# Altium schematic sheet 08_MCU.SchDoc
size 420 x 297 mm; SheetNumber: 15; SheetTotal: 29
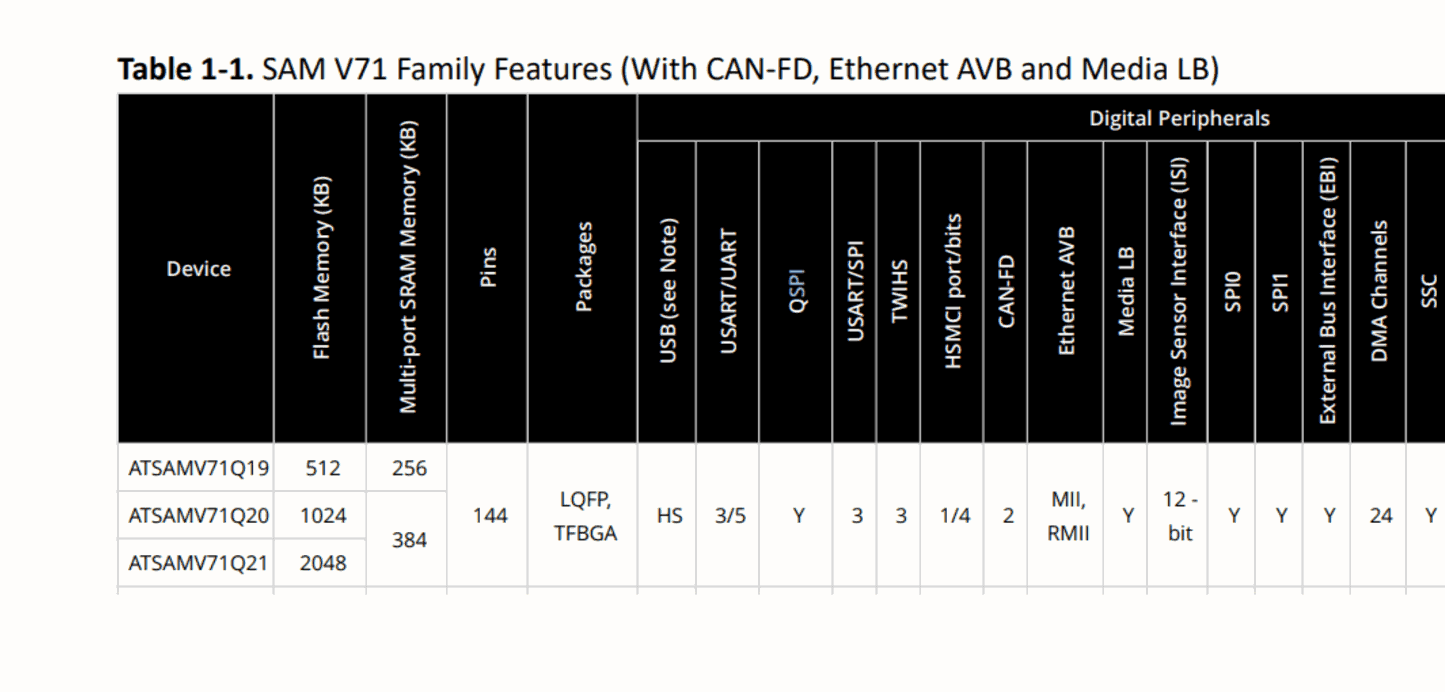
[diagram p0: 08_MCU.SchDoc, top left]
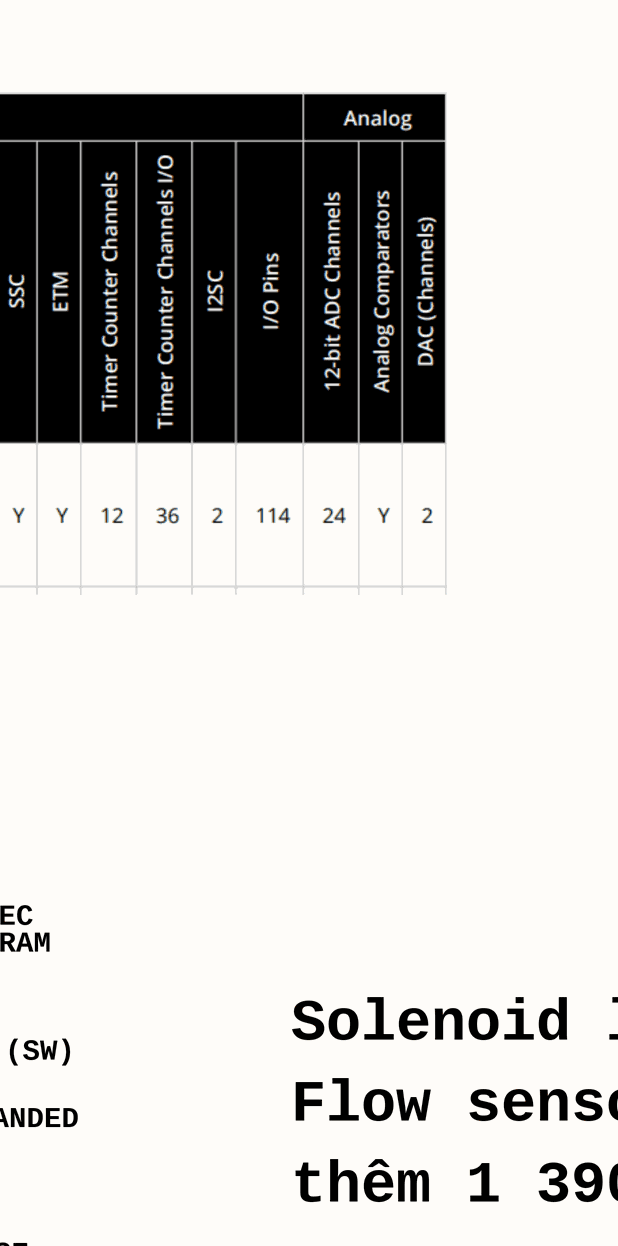
[diagram p1: 08_MCU.SchDoc, top right]
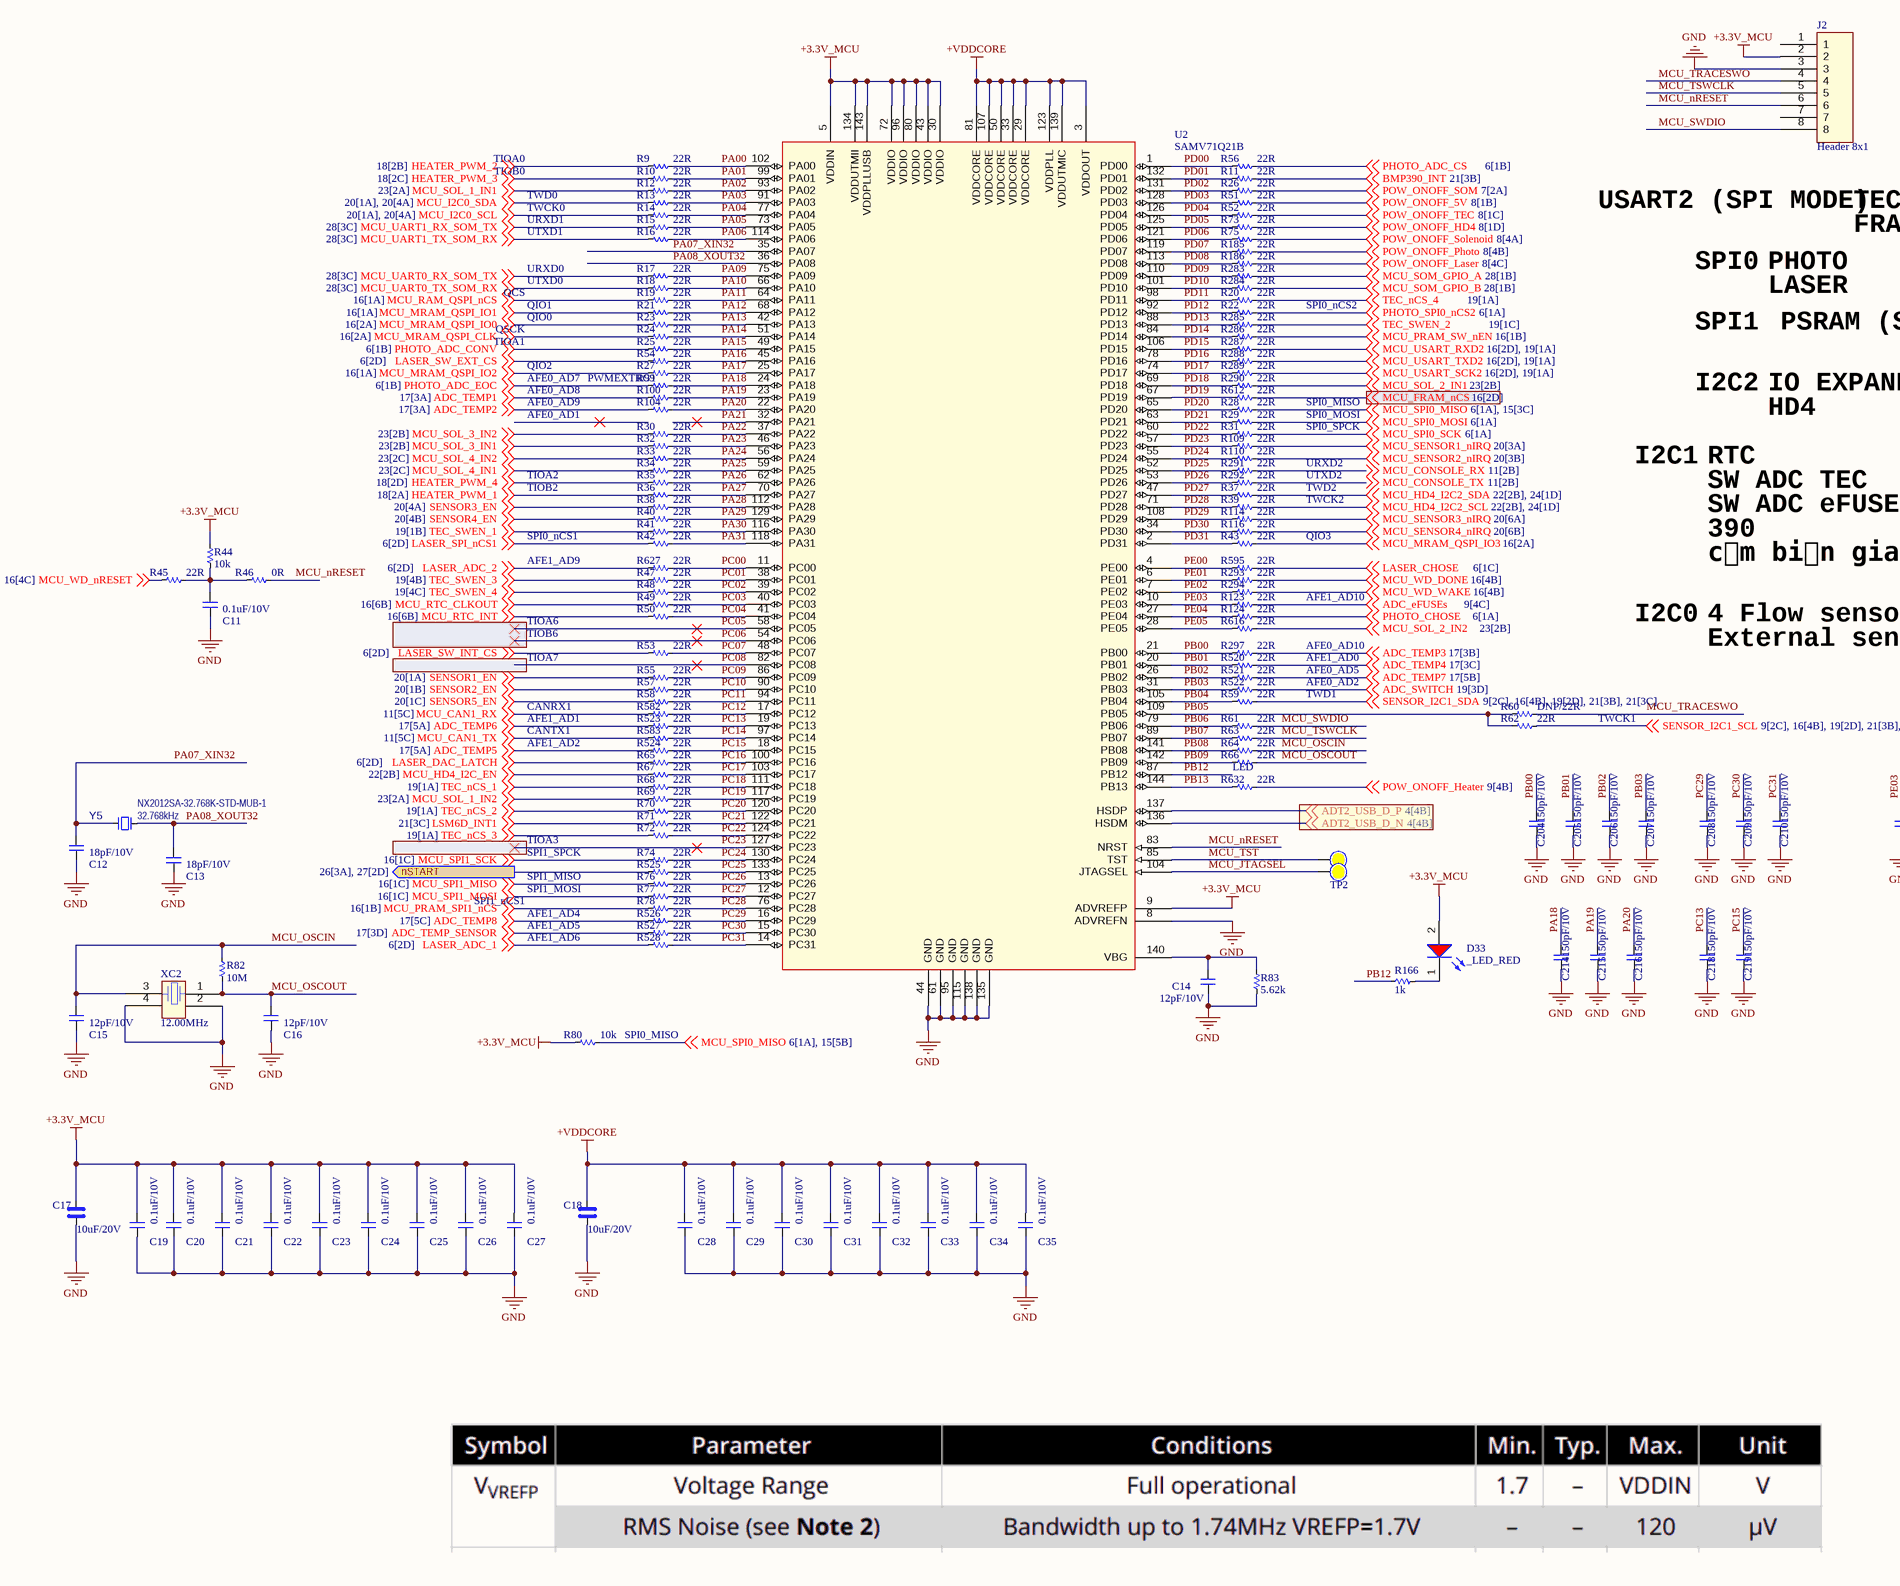
[diagram p2: 08_MCU.SchDoc, bottom left]
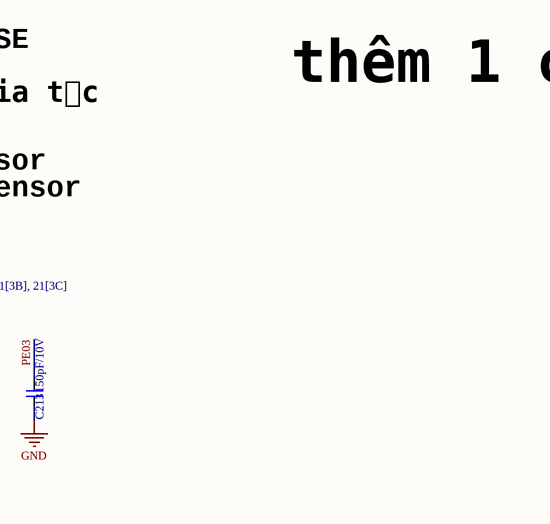
[diagram p3: 08_MCU.SchDoc, bottom right]

## Parts
C11  0.1uF/10V  [CAP_C_1005X60]
C12  18pF/10V  [CAP_C_1005X60]
C13  18pF/10V  [CAP_C_1005X60]
C14  12pF/10V  [CAP_C_1005X60]
C15  12pF/10V  [CAP_C_1005X60]
C16  12pF/10V  [CAP_C_1005X60]
C17  10uF/20V  [CAP_C_2012X110]
C18  10uF/20V  [CAP_C_2012X110]
C19  0.1uF/10V  [CAP_C_1005X60]
C20  0.1uF/10V  [CAP_C_1005X60]
C21  0.1uF/10V  [CAP_C_1005X60]
C22  0.1uF/10V  [CAP_C_1005X60]
C23  0.1uF/10V  [CAP_C_1005X60]
C24  0.1uF/10V  [CAP_C_1005X60]
C25  0.1uF/10V  [CAP_C_1005X60]
C26  0.1uF/10V  [CAP_C_1005X60]
C27  0.1uF/10V  [CAP_C_1005X60]
C28  0.1uF/10V  [CAP_C_1005X60]
C29  0.1uF/10V  [CAP_C_1005X60]
C30  0.1uF/10V  [CAP_C_1005X60]
C31  0.1uF/10V  [CAP_C_1005X60]
C32  0.1uF/10V  [CAP_C_1005X60]
C33  0.1uF/10V  [CAP_C_1005X60]
C34  0.1uF/10V  [CAP_C_1005X60]
C35  0.1uF/10V  [CAP_C_1005X60]
C204  150pF/10V  [CAP_C_1005X60]
C205  150pF/10V  [CAP_C_1005X60]
C206  150pF/10V  [CAP_C_1005X60]
C207  150pF/10V  [CAP_C_1005X60]
C208  150pF/10V  [CAP_C_1005X60]
C209  150pF/10V  [CAP_C_1005X60]
C210  150pF/10V  [CAP_C_1005X60]
C213  150pF/10V  [CAP_C_1005X60]
C214  150pF/10V  [CAP_C_1005X60]
C215  150pF/10V  [CAP_C_1005X60]
C216  150pF/10V  [CAP_C_1005X60]
C218  150pF/10V  [CAP_C_1005X60]
C219  150pF/10V  [CAP_C_1005X60]
D33  _LED_RED  [LED_0603]
J2  Header 8x1  [Header_254P_8x1]
R9  22R  [RES_C_1005X40]
R10  22R  [RES_C_1005X40]
R11  22R  [RES_C_1005X40]
R12  22R  [RES_C_1005X40]
R13  22R  [RES_C_1005X40]
R14  22R  [RES_C_1005X40]
R15  22R  [RES_C_1005X40]
R16  22R  [RES_C_1005X40]
R17  22R  [RES_C_1005X40]
R18  22R  [RES_C_1005X40]
R19  22R  [RES_C_1005X40]
R20  22R  [RES_C_1005X40]
R21  22R  [RES_C_1005X40]
R22  22R  [RES_C_1005X40]
R23  22R  [RES_C_1005X40]
R24  22R  [RES_C_1005X40]
R25  22R  [RES_C_1005X40]
R26  22R  [RES_C_1005X40]
R27  22R  [RES_C_1005X40]
R28  22R  [RES_C_1005X40]
R29  22R  [RES_C_1005X40]
R30  22R  [RES_C_1005X40]
R31  22R  [RES_C_1005X40]
R32  22R  [RES_C_1005X40]
R33  22R  [RES_C_1005X40]
R34  22R  [RES_C_1005X40]
R35  22R  [RES_C_1005X40]
R36  22R  [RES_C_1005X40]
R37  22R  [RES_C_1005X40]
R38  22R  [RES_C_1005X40]
R39  22R  [RES_C_1005X40]
R40  22R  [RES_C_1005X40]
R41  22R  [RES_C_1005X40]
R42  22R  [RES_C_1005X40]
R43  22R  [RES_C_1005X40]
R44  10k  [RES_C_1005X40]
R45  22R  [RES_C_1005X40]
R46  0R  [RES_C_1005X40]
R47  22R  [RES_C_1005X40]
R48  22R  [RES_C_1005X40]
R49  22R  [RES_C_1005X40]
R50  22R  [RES_C_1005X40]
R51  22R  [RES_C_1005X40]
R52  22R  [RES_C_1005X40]
R53  22R  [RES_C_1005X40]
R54  22R  [RES_C_1005X40]
R55  22R  [RES_C_1005X40]
R56  22R  [RES_C_1005X40]
R57  22R  [RES_C_1005X40]
R58  22R  [RES_C_1005X40]
R59  22R  [RES_C_1005X40]
R60  DNP/22R  [RES_C_1005X40]
R61  22R  [RES_C_1005X40]
R62  22R  [RES_C_1005X40]
R63  22R  [RES_C_1005X40]
R64  22R  [RES_C_1005X40]
R65  22R  [RES_C_1005X40]
R66  22R  [RES_C_1005X40]
R67  22R  [RES_C_1005X40]
R68  22R  [RES_C_1005X40]
R69  22R  [RES_C_1005X40]
R70  22R  [RES_C_1005X40]
R71  22R  [RES_C_1005X40]
R72  22R  [RES_C_1005X40]
R73  22R  [RES_C_1005X40]
R74  22R  [RES_C_1005X40]
R75  22R  [RES_C_1005X40]
R76  22R  [RES_C_1005X40]
R77  22R  [RES_C_1005X40]
R78  22R  [RES_C_1005X40]
R80  10k  [RES_C_1005X40]
R82  10M  [RES_C_1005X40]
R83  5.62k  [RES_C_1005X40]
R99  22R  [RES_C_1005X40]
R100  22R  [RES_C_1005X40]
R104  22R  [RES_C_1005X40]
R109  22R  [RES_C_1005X40]
R110  22R  [RES_C_1005X40]
R114  22R  [RES_C_1005X40]
R116  22R  [RES_C_1005X40]
R123  22R  [RES_C_1005X40]
R124  22R  [RES_C_1005X40]
R166  1k  [RES_C_1005X40]
R185  22R  [RES_C_1005X40]
R186  22R  [RES_C_1005X40]
R283  22R  [RES_C_1005X40]
R284  22R  [RES_C_1005X40]
R285  22R  [RES_C_1005X40]
R286  22R  [RES_C_1005X40]
R287  22R  [RES_C_1005X40]
R288  22R  [RES_C_1005X40]
R289  22R  [RES_C_1005X40]
R290  22R  [RES_C_1005X40]
R291  22R  [RES_C_1005X40]
R292  22R  [RES_C_1005X40]
R293  22R  [RES_C_1005X40]
R294  22R  [RES_C_1005X40]
R297  22R  [RES_C_1005X40]
R520  22R  [RES_C_1005X40]
R521  22R  [RES_C_1005X40]
R522  22R  [RES_C_1005X40]
R523  22R  [RES_C_1005X40]
R524  22R  [RES_C_1005X40]
R525  22R  [RES_C_1005X40]
R526  22R  [RES_C_1005X40]
R527  22R  [RES_C_1005X40]
R528  22R  [RES_C_1005X40]
R582  22R  [RES_C_1005X40]
R583  22R  [RES_C_1005X40]
R595  22R  [RES_C_1005X40]
R612  22R  [RES_C_1005X40]
R616  22R  [RES_C_1005X40]
R627  22R  [RES_C_1005X40]
R632  22R  [RES_C_1005X40]
TP1  (no value)  [Testpoint_TH_D130H80]  (no BOM)
TP2  (no value)  [Testpoint_TH_D130H80]  (no BOM)
U2  SAMV71Q21B  [AP6-00118]
XC2  value 12.00MHz  [AP7-00039]
Y5  value 32.768kHz  Manufacturer Part Number 1: NX2012SA-32.768K-STD-MUB-1  [CRYSTAL_NX2012SA]  (hidden comment: Crystal 2 Pins)

## Ports
nSTART (out, see 26[3A], 27[2D])

## Nets
+3.3V_MCU: C17.1 C19.2 C20.2 C21.2 C22.2 C23.2 C24.2 C25.2 C26.2 C27.2 D33.2(A) J2.2 R44.2 R80.2 U2.5(VDDIN) U2.9(ADVREFP) U2.30(VDDIO) U2.43(VDDIO) U2.72(VDDIO) U2.80(VDDIO) U2.96(VDDIO) U2.134(VDDUTMII) U2.143(VDDPLLUSB)
+VDDCORE: C18.1 C28.2 C29.2 C30.2 C31.2 C32.2 C33.2 C34.2 C35.2 U2.3(VDDOUT) U2.29(VDDCORE) U2.33(VDDCORE) U2.50(VDDCORE) U2.81(VDDCORE) U2.107(VDDCORE) U2.123(VDDPLL) U2.139(VDDUTMIC)
GND: C11.1 C12.1 C13.1 C14.1 C15.1 C16.1 C17.2 C18.2 C19.1 C20.1 C21.1 C22.1 C23.1 C24.1 C25.1 C26.1 C27.1 C28.1 C29.1 C30.1 C31.1 C32.1 C33.1 C34.1 C35.1 C204.1 C205.1 C206.1 C207.1 C208.1 C209.1 C210.1 C213.1 C214.1 C215.1 C216.1 C218.1 C219.1 J2.3 R83.1 U2.8(ADVREFN) U2.44(GND) U2.61(GND) U2.95(GND) U2.115(GND) U2.135(GND) U2.138(GND) XC2.2 XC2.4
ADC_eFUSEs: R123.1 ; off-sheet ADC_eFUSEs
ADC_SWITCH: R522.1 ; off-sheet ADC_SWITCH
ADC_TEMP1: R100.2 ; off-sheet ADC_TEMP1
ADC_TEMP2: R104.2 ; off-sheet ADC_TEMP2
ADC_TEMP3: R297.1 ; off-sheet ADC_TEMP3
ADC_TEMP4: R520.1 ; off-sheet ADC_TEMP4
ADC_TEMP5: R524.2 ; off-sheet ADC_TEMP5
ADC_TEMP6: R523.2 ; off-sheet ADC_TEMP6
ADC_TEMP7: R521.1 ; off-sheet ADC_TEMP7
ADC_TEMP8: R526.2 ; off-sheet ADC_TEMP8
ADC_TEMP_SENSOR: R527.2 ; off-sheet ADC_TEMP_SENSOR
ADT2_USB_D_N: U2.136(HSDM) ; off-sheet ADT2_USB_D_N
ADT2_USB_D_P: U2.137(HSDP) ; off-sheet ADT2_USB_D_P
BMP390_INT: R11.1 ; off-sheet BMP390_INT
HEATER_PWM_1: R36.2 ; off-sheet HEATER_PWM_1
HEATER_PWM_2: R9.2 ; off-sheet HEATER_PWM_2
HEATER_PWM_3: R10.2 ; off-sheet HEATER_PWM_3
HEATER_PWM_4: R35.2 ; off-sheet HEATER_PWM_4
LASER_ADC_1: R528.2 ; off-sheet LASER_ADC_1
LASER_ADC_2: R627.2 ; off-sheet LASER_ADC_2
LASER_CHOSE: R595.1 ; off-sheet LASER_CHOSE
LASER_DAC_LATCH: R65.2 ; off-sheet LASER_DAC_LATCH
LASER_SPI_nCS1: R42.2 ; off-sheet LASER_SPI_nCS1
LASER_SW_EXT_CS: R54.2 ; off-sheet LASER_SW_EXT_CS
LASER_SW_INT_CS: R53.2 ; off-sheet LASER_SW_INT_CS
LSM6D_INT1: R71.2 ; off-sheet LSM6D_INT1
MCU_CAN1_RX: R582.2 ; off-sheet MCU_CAN1_RX
MCU_CAN1_TX: R583.2 ; off-sheet MCU_CAN1_TX
MCU_CONSOLE_RX: R291.1 ; off-sheet MCU_CONSOLE_RX
MCU_CONSOLE_TX: R292.1 ; off-sheet MCU_CONSOLE_TX
MCU_FRAM_nCS: R612.1 ; off-sheet MCU_FRAM_nCS
MCU_HD4_I2C2_SCL: R39.1 ; off-sheet MCU_HD4_I2C2_SCL
MCU_HD4_I2C2_SDA: R37.1 ; off-sheet MCU_HD4_I2C2_SDA
MCU_HD4_I2C_EN: R67.2 ; off-sheet MCU_HD4_I2C_EN
MCU_I2C0_SCL: R14.2 ; off-sheet MCU_I2C0_SCL
MCU_I2C0_SDA: R13.2 ; off-sheet MCU_I2C0_SDA
MCU_JTAGSEL: TP2.1 U2.104(JTAGSEL)
MCU_MRAM_QSPI_CLK: R24.2 ; off-sheet MCU_MRAM_QSPI_CLK
MCU_MRAM_QSPI_IO0: R23.2 ; off-sheet MCU_MRAM_QSPI_IO0
MCU_MRAM_QSPI_IO1: R21.2 ; off-sheet MCU_MRAM_QSPI_IO1
MCU_MRAM_QSPI_IO2: R27.2 ; off-sheet MCU_MRAM_QSPI_IO2
MCU_MRAM_QSPI_IO3: R43.1 ; off-sheet MCU_MRAM_QSPI_IO3
MCU_nRESET: J2.6 R46.1 U2.83(NRST)
MCU_OSCIN: C15.2 R64.1 R82.2 XC2.3
MCU_OSCOUT: C16.2 R66.1 R82.1 XC2.1
MCU_PRAM_SPI1_nCS: R78.2 ; off-sheet MCU_PRAM_SPI1_nCS
MCU_PRAM_SW_nEN: R286.1 ; off-sheet MCU_PRAM_SW_nEN
MCU_RAM_QSPI_nCS: R19.2 ; off-sheet MCU_RAM_QSPI_nCS
MCU_RTC_CLKOUT: R49.2 ; off-sheet MCU_RTC_CLKOUT
MCU_RTC_INT: R50.2 ; off-sheet MCU_RTC_INT
MCU_SENSOR1_nIRQ: R109.1 ; off-sheet MCU_SENSOR1_nIRQ
MCU_SENSOR2_nIRQ: R110.1 ; off-sheet MCU_SENSOR2_nIRQ
MCU_SENSOR3_nIRQ: R114.1 ; off-sheet MCU_SENSOR3_nIRQ
MCU_SENSOR4_nIRQ: R116.1 ; off-sheet MCU_SENSOR4_nIRQ
MCU_SOL_1_IN1: R12.2 ; off-sheet MCU_SOL_1_IN1
MCU_SOL_1_IN2: R69.2 ; off-sheet MCU_SOL_1_IN2
MCU_SOL_2_IN1: R290.1 ; off-sheet MCU_SOL_2_IN1
MCU_SOL_2_IN2: R616.1 ; off-sheet MCU_SOL_2_IN2
MCU_SOL_3_IN1: R32.2 ; off-sheet MCU_SOL_3_IN1
MCU_SOL_3_IN2: R30.2 ; off-sheet MCU_SOL_3_IN2
MCU_SOL_4_IN1: R34.2 ; off-sheet MCU_SOL_4_IN1
MCU_SOL_4_IN2: R33.2 ; off-sheet MCU_SOL_4_IN2
MCU_SOM_GPIO_A: R283.1 ; off-sheet MCU_SOM_GPIO_A
MCU_SOM_GPIO_B: R284.1 ; off-sheet MCU_SOM_GPIO_B
MCU_SPI0_MISO: R28.1 R80.1 ; off-sheet MCU_SPI0_MISO
MCU_SPI0_MOSI: R29.1 ; off-sheet MCU_SPI0_MOSI
MCU_SPI0_SCK: R31.1 ; off-sheet MCU_SPI0_SCK
MCU_SPI1_MISO: R76.2 ; off-sheet MCU_SPI1_MISO
MCU_SPI1_MOSI: R77.2 ; off-sheet MCU_SPI1_MOSI
MCU_SPI1_SCK: R74.2 ; off-sheet MCU_SPI1_SCK
MCU_SWDIO: J2.8 R61.1
MCU_TRACESWO: J2.4 R60.1
MCU_TST: TP1.1 U2.85(TST)
MCU_TSWCLK: J2.5 R63.1
MCU_UART0_RX_SOM_TX: R17.2 ; off-sheet MCU_UART0_RX_SOM_TX
MCU_UART0_TX_SOM_RX: R18.2 ; off-sheet MCU_UART0_TX_SOM_RX
MCU_UART1_RX_SOM_TX: R15.2 ; off-sheet MCU_UART1_RX_SOM_TX
MCU_UART1_TX_SOM_RX: R16.2 ; off-sheet MCU_UART1_TX_SOM_RX
MCU_USART_RXD2: R287.1 ; off-sheet MCU_USART_RXD2
MCU_USART_SCK2: R289.1 ; off-sheet MCU_USART_SCK2
MCU_USART_TXD2: R288.1 ; off-sheet MCU_USART_TXD2
MCU_WD_DONE: R293.1 ; off-sheet MCU_WD_DONE
MCU_WD_nRESET: R45.2 ; off-sheet MCU_WD_nRESET
MCU_WD_WAKE: R294.1 ; off-sheet MCU_WD_WAKE
nSTART: R525.2 ; port nSTART
PA00: R9.1 U2.102(PA00)
PA01: R10.1 U2.99(PA01)
PA02: R12.1 U2.93(PA02)
PA03: R13.1 U2.91(PA03)
PA04: R14.1 U2.77(PA04)
PA05: R15.1 U2.73(PA05)
PA06: R16.1 U2.114(PA06)
PA07_XIN32: C12.2 U2.35(PA07) Y5.2(Osc2)
PA08_XOUT32: C13.2 U2.36(PA08) Y5.1(Osc1)
PA09: R17.1 U2.75(PA09)
PA10: R18.1 U2.66(PA10)
PA11: R19.1 U2.64(PA11)
PA12: R21.1 U2.68(PA12)
PA13: R23.1 U2.42(PA13)
PA14: R24.1 U2.51(PA14)
PA15: R25.1 U2.49(PA15)
PA16: R54.1 U2.45(PA16)
PA17: R27.1 U2.25(PA17)
PA18: C214.2 R99.1 U2.24(PA18)
PA19: C215.2 R100.1 U2.23(PA19)
PA20: C216.2 R104.1 U2.22(PA20)
PA21: U2.32(PA21)
PA22: R30.1 U2.37(PA22)
PA23: R32.1 U2.46(PA23)
PA24: R33.1 U2.56(PA24)
PA25: R34.1 U2.59(PA25)
PA26: R35.1 U2.62(PA26)
PA27: R36.1 U2.70(PA27)
PA28: R38.1 U2.112(PA28)
PA29: R40.1 U2.129(PA29)
PA30: R41.1 U2.116(PA30)
PA31: R42.1 U2.118(PA31)
PB00: C204.2 R297.2 U2.21(PB00)
PB01: C205.2 R520.2 U2.20(PB01)
PB02: C206.2 R521.2 U2.26(PB02)
PB03: C207.2 R522.2 U2.31(PB03)
PB04: R59.2 U2.105(PB04)
PB05: R60.2 R62.2 U2.109(PB05)
PB06: R61.2 U2.79(PB06)
PB07: R63.2 U2.89(PB07)
PB08: R64.2 U2.141(PB08)
PB09: R66.2 U2.142(PB09)
PB12: R166.1 U2.87(PB12)
PB13: R632.2 U2.144(PB13)
PC00: R627.1 U2.11(PC00)
PC01: R47.1 U2.38(PC01)
PC02: R48.1 U2.39(PC02)
PC03: R49.1 U2.40(PC03)
PC04: R50.1 U2.41(PC04)
PC05: U2.58(PC05)
PC06: U2.54(PC06)
PC07: R53.1 U2.48(PC07)
PC08: U2.82(PC08)
PC09: R55.1 U2.86(PC09)
PC10: R57.1 U2.90(PC10)
PC11: R58.1 U2.94(PC11)
PC12: R582.1 U2.17(PC12)
PC13: C218.2 R523.1 U2.19(PC13)
PC14: R583.1 U2.97(PC14)
PC15: C219.2 R524.1 U2.18(PC15)
PC16: R65.1 U2.100(PC16)
PC17: R67.1 U2.103(PC17)
PC18: R68.1 U2.111(PC18)
PC19: R69.1 U2.117(PC19)
PC20: R70.1 U2.120(PC20)
PC21: R71.1 U2.122(PC21)
PC22: R72.1 U2.124(PC22)
PC23: U2.127(PC23)
PC24: R74.1 U2.130(PC24)
PC25: R525.1 U2.133(PC25)
PC26: R76.1 U2.13(PC26)
PC27: R77.1 U2.12(PC27)
PC28: R78.1 U2.76(PC28)
PC29: C208.2 R526.1 U2.16(PC29)
PC30: C209.2 R527.1 U2.15(PC30)
PC31: C210.2 R528.1 U2.14(PC31)
PD00: R56.2 U2.1(PD00)
PD01: R11.2 U2.132(PD01)
PD02: R26.2 U2.131(PD02)
PD03: R51.2 U2.128(PD03)
PD04: R52.2 U2.126(PD04)
PD05: R73.2 U2.125(PD05)
PD06: R75.2 U2.121(PD06)
PD07: R185.2 U2.119(PD07)
PD08: R186.2 U2.113(PD08)
PD09: R283.2 U2.110(PD09)
PD10: R284.2 U2.101(PD10)
PD11: R20.2 U2.98(PD11)
PD12: R22.2 U2.92(PD12)
PD13: R285.2 U2.88(PD13)
PD14: R286.2 U2.84(PD14)
PD15: R287.2 U2.106(PD15)
PD16: R288.2 U2.78(PD16)
PD17: R289.2 U2.74(PD17)
PD18: R290.2 U2.69(PD18)
PD19: R612.2 U2.67(PD19)
PD20: R28.2 U2.65(PD20)
PD21: R29.2 U2.63(PD21)
PD22: R31.2 U2.60(PD22)
PD23: R109.2 U2.57(PD23)
PD24: R110.2 U2.55(PD24)
PD25: R291.2 U2.52(PD25)
PD26: R292.2 U2.53(PD26)
PD27: R37.2 U2.47(PD27)
PD28: R39.2 U2.71(PD28)
PD29: R114.2 U2.108(PD29)
PD30: R116.2 U2.34(PD30)
PD31: R43.2 U2.2(PD31)
PE00: R595.2 U2.4(PE00)
PE01: R293.2 U2.6(PE01)
PE02: R294.2 U2.7(PE02)
PE03: C213.2 R123.2 U2.10(PE03)
PE04: R124.2 U2.27(PE04)
PE05: R616.2 U2.28(PE05)
PHOTO_ADC_CONV: R25.2 ; off-sheet PHOTO_ADC_CONV
PHOTO_ADC_CS: R56.1 ; off-sheet PHOTO_ADC_CS
PHOTO_ADC_EOC: R99.2 ; off-sheet PHOTO_ADC_EOC
PHOTO_CHOSE: R124.1 ; off-sheet PHOTO_CHOSE
PHOTO_SPI0_nCS2: R22.1 ; off-sheet PHOTO_SPI0_nCS2
POW_ONOFF_5V: R51.1 ; off-sheet POW_ONOFF_5V
POW_ONOFF_HD4: R73.1 ; off-sheet POW_ONOFF_HD4
POW_ONOFF_Heater: R632.1 ; off-sheet POW_ONOFF_Heater
POW_ONOFF_Laser: R186.1 ; off-sheet POW_ONOFF_Laser
POW_ONOFF_Photo: R185.1 ; off-sheet POW_ONOFF_Photo
POW_ONOFF_Solenoid: R75.1 ; off-sheet POW_ONOFF_Solenoid
POW_ONOFF_SOM: R26.1 ; off-sheet POW_ONOFF_SOM
POW_ONOFF_TEC: R52.1 ; off-sheet POW_ONOFF_TEC
SENSOR1_EN: R55.2 ; off-sheet SENSOR1_EN
SENSOR2_EN: R57.2 ; off-sheet SENSOR2_EN
SENSOR3_EN: R38.2 ; off-sheet SENSOR3_EN
SENSOR4_EN: R40.2 ; off-sheet SENSOR4_EN
SENSOR5_EN: R58.2 ; off-sheet SENSOR5_EN
SENSOR_I2C1_SCL: R62.1 ; off-sheet SENSOR_I2C1_SCL
SENSOR_I2C1_SDA: R59.1 ; off-sheet SENSOR_I2C1_SDA
TEC_nCS_1: R68.2 ; off-sheet TEC_nCS_1
TEC_nCS_2: R70.2 ; off-sheet TEC_nCS_2
TEC_nCS_3: R72.2 ; off-sheet TEC_nCS_3
TEC_nCS_4: R20.1 ; off-sheet TEC_nCS_4
TEC_SWEN_1: R41.2 ; off-sheet TEC_SWEN_1
TEC_SWEN_2: R285.1 ; off-sheet TEC_SWEN_2
TEC_SWEN_3: R47.2 ; off-sheet TEC_SWEN_3
TEC_SWEN_4: R48.2 ; off-sheet TEC_SWEN_4
NetC11_2: C11.2 R44.1 R45.1 R46.2
NetC14_2: C14.2 R83.2 U2.140(VBG)
NetD33_1: D33.1(K) R166.2

Not connected (* = marked no-connect by the designer): J2 1 7

## Notes on the sheet
- TWD0
- TWCK0
- TIOA0
- TIOB0
- USART2 (SPI MODE)
- TEC
- URXD1
- UTXD1
- URXD0
- SPI0
- PHOTO
- FRAM
- UTXD0
- QIO1
- QCS
- QSCK
- QIO0
- SPI0_nCS2
- SPI1
- LASER
- PSRAM (SW)
- Solenoid lên 16 cái
- QIO2
- AFE0_AD8
- AFE0_AD7
- TIOA1
- PWMEXTRG1
- I2C2
- IO EXPANDED
- Flow sensor thêm 2 cái
- AFE0_AD1
- AFE0_AD9
- SPI0_MISO
- SPI0_MOSI
- SPI0_SPCK
- HD4
- TIOA2
- TIOB2
- TWD2
- TWCK2
- URXD2
- UTXD2
- I2C1
- RTC
- SW ADC TEC
- SW ADC eFUSE
- thêm 1 390 onboard
- SPI0_nCS1
- AFE1_AD9
- QIO3
- 390
- cảm biến gia tốc
- thêm 1 con cbien gia tốc
- TIOA6
- TIOB6
- AFE1_AD10
- I2C0
- 4 Flow sensor
- TIOA7
- AFE0_AD2
- AFE0_AD10
- AFE0_AD5
- AFE1_AD0
- TWD1
- External sensor
- AFE1_AD2
- AFE1_AD1
- CANRX1
- CANTX1
- TWCK1
- (near R66) LED
- SPI1_MISO
- SPI1_SPCK
- TIOA3
- SPI1_nCS1
- SPI1_MOSI
- AFE1_AD4
- AFE1_AD5
- AFE1_AD6
- (near R80) SPI0_MISO
- Project:
- Sub-system:
- Design by:
- Sheet title:
- Sheet
- of
- Checked by:
- Approved by:
- Revision:
- Document No:
- Size:
- Date:
- A3

## Library data of the parts
C11-C16 C19-C35 C204-C210 C213-C216 C218 C219 = _CAP_C_2: CAP CHIP
C17 C18 = _CAP_C_High_2: CAP CHIP High Value
R9-R78 R80 R82 R83 R99 R100 R104 R109 R110 R114 R116 R123 R124 R166 R185 R186 R283-R294 R297 R520-R528 R582 R583 R595 R612 R616 R627 R632 = _RES_B_2: RES
TP1 TP2 = Test Point: Solder: NF
U2 = A06-1541: SAM 32-bit ARM Cortex-M* RISC MCU, SAMV71B Series, QFP144; PartGroup: Integrated Circuits,MCU, MPU, DSP,ARM MCU; Manufacturer: MICROCHIP; MPN: ATSAMV71Q21B-AAB; TemperatureRange: -40Â°C to +105Â°C; AN: A06-1541; Value: SAMV71Q21B; Height: 1,60000002384186
XC2 = A07-0042: Fox FQ5032B 12.0MHz SMD crystal 738B-12; PartGroup: Frequency devices,Crystals,SMD; Manufacturer: Fox  Electronics; MPN: FQ5032B-12.000; Tolerance: Â±30ppm; TemperatureRange: 0Â°C ~ 70Â°C; AN: A07-0042; Height: 1,20000004768372
Y5 = OSC1092: Crystal; Manufacturer 1: NDK; Description_: CRYSTAL 32.768kHz 12.5pF SMD NX2012SA; Dev Tools Status: Production; Owner: Jamus Griego; Tolerance: ±20ppm; Load Capacitance: 12.5pF; Populated: YES; MCHP-ID: OSC1092; Revision: 1; Symbol: Crystal 2 Pins; Status: MCL Design; ComponentLink1URL: https://chn-vm-apps.microchip.com/mchprepo/parts/Datasheets/c_NX2012SA-STD-MUB-1_e.pdf; ComponentLink1Description: SVN Datasheet; ComponentLink2URL: C:\ALTIUM_WORK\00001_MCHP-CDB\Datasheets\c_NX2012SA-STD-MUB-1_e.pdf; ComponentLink2Description: Local Datasheet; ComponentLink3URL: C:\ALTIUM_WORK\00001_MCHP-CDB\Library\LibraryRefs\Crystal 2 Pins.SchLib; ComponentLink3Description: Open Symbol; ComponentLink4URL: C:\ALTIUM_WORK\00001_MCHP-CDB\Library\Footprints\CRYSTAL_NX2012SA.PcbLib; ComponentLink4Description: Open Footprint; ComponentLink5Description: Open Footprint 2; ComponentLink6Description: Open Footprint 3; ComponentLink7Description: Open Footprint 4; Type: Crystal; Category: Crystal/Oscillator; Supplier 1: Digi-Key; Supplier Part Number 1: 644-1219-1-ND; Quantity Override: 1